# EAGLE design emonVS (EAGLE 9.6.2)
AUTHOR: OpenEnergyMonitor; IGNORE_RENUMBER: F;RV; SOURCE: github.com/openenergymonitor/emonVoltageSense; VERSION: 1.3.2
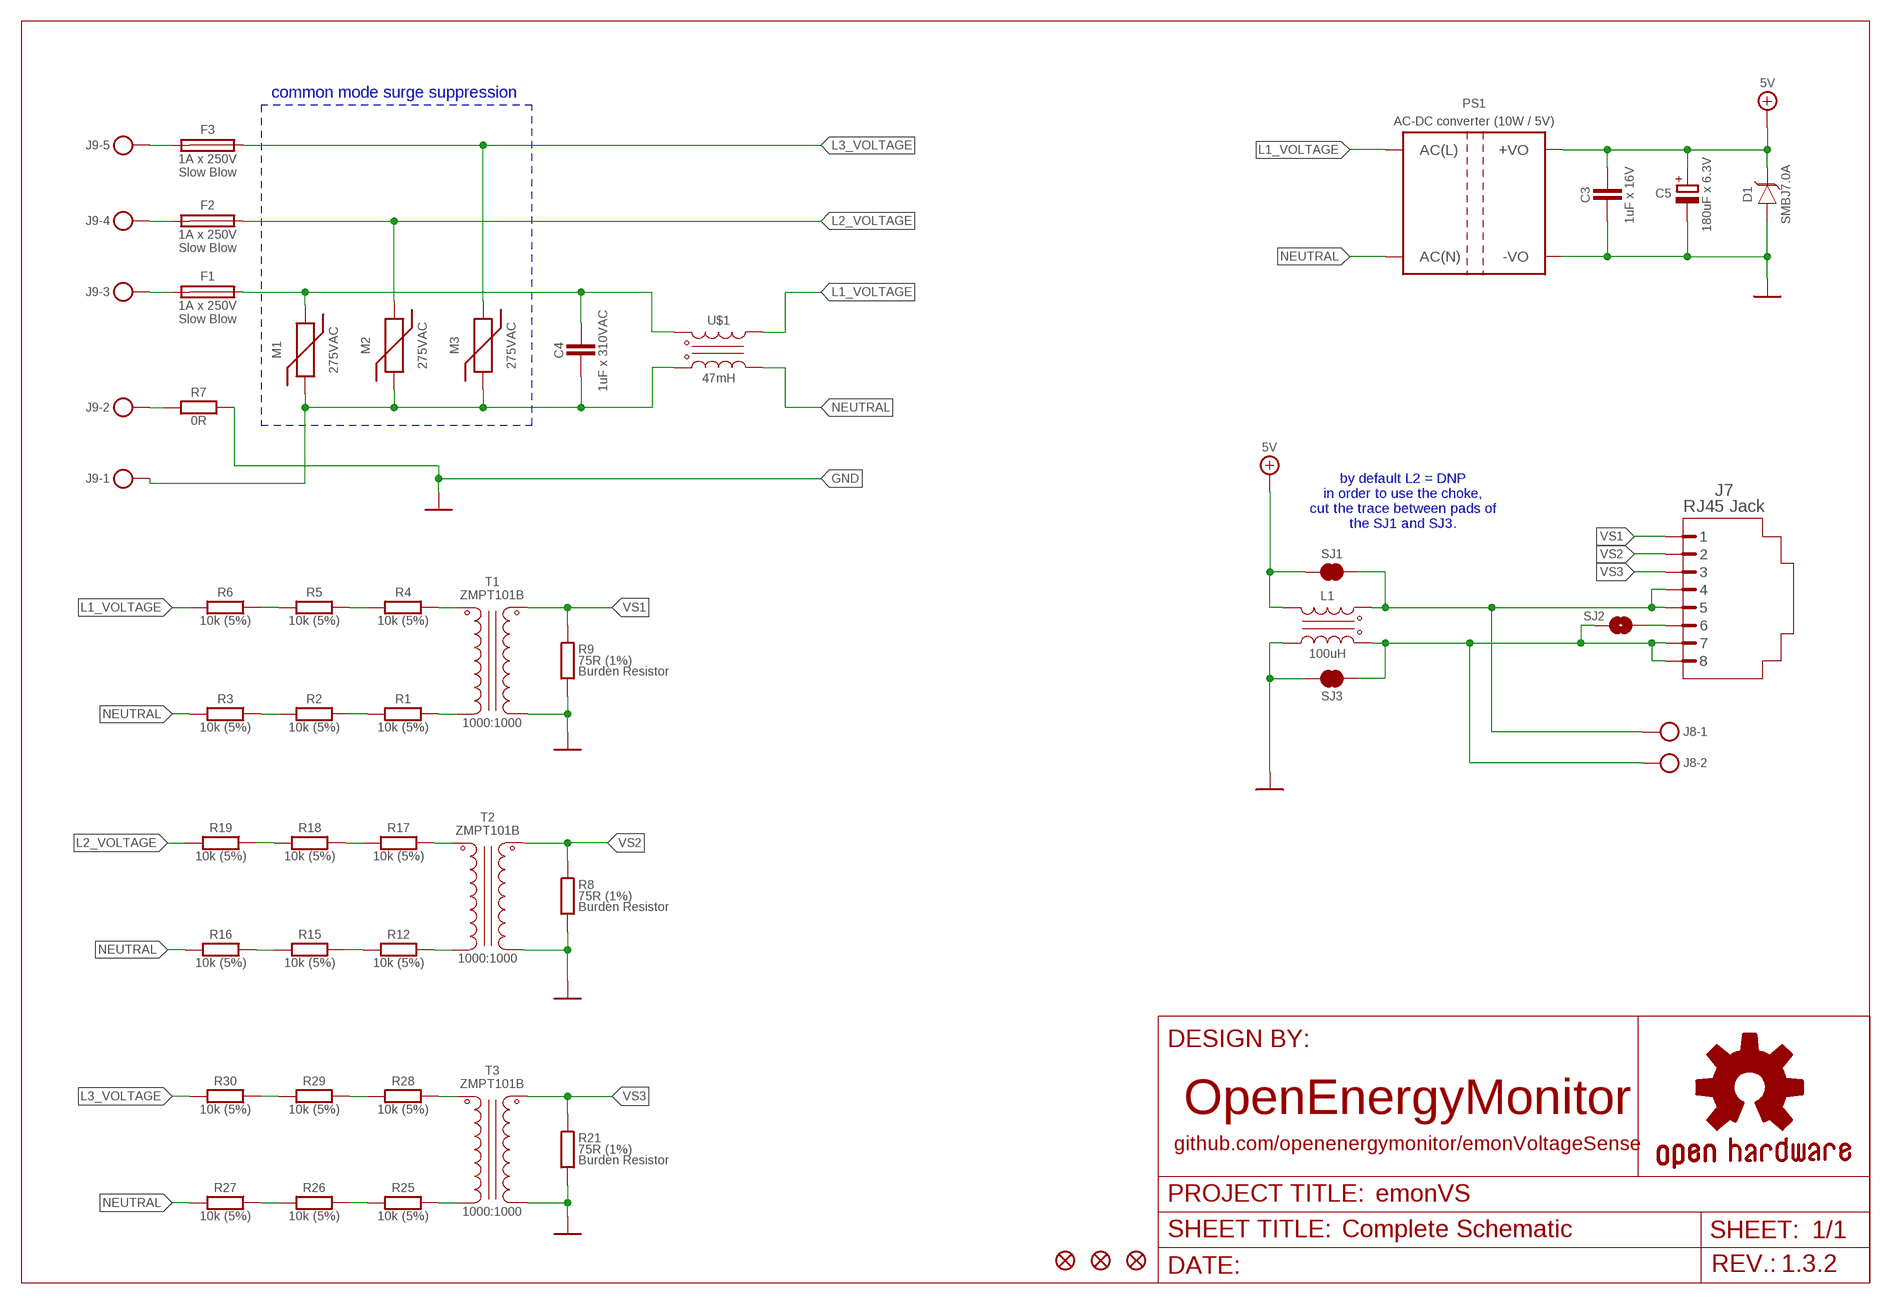
[diagram p0: schematic, sheet 1]

## Parts
C3  1uF x 16V  C_0603  [C0603]
C4  1uF x 310VAC  C_  [C_PTH]
C5  180uF x 6.3V  CP_SV-C  [CSV-C]
D1  TVS  [DO-214AA]
F1  1A x 250V  FUSE  [FUSE]
F2  1A x 250V  FUSE  [FUSE]
F3  1A x 250V  FUSE  [FUSE]
FD1  FIDUCIAL1X2  [FIDUCIAL]
FD2  FIDUCIAL1X2  [FIDUCIAL]
FD3  FIDUCIAL1X2  [FIDUCIAL]
J7  RJ45 Jack  RJ45-8PPTH  [RJ45-8P]
J8  TERMINAL_BLOCK_2P  [TERMINAL_BLOCK_2P]
J9  TERMINAL_BLOCK_5P  [TERMINAL_BLOCK_5P]
L1  100uH  CHOKES-WE-SL3  [CHOKE_WURTH]
M1  275VAC  MOV_14MM_275VAC  [MOV]
M2  275VAC  MOV_14MM_275VAC  [MOV]
M3  275VAC  MOV_14MM_275VAC  [MOV]
PS1  AC-DC converter (10W / 5V)  MULTICOMP-AC/DC  [MULTICOMP-AC/DC]
R1  10k (5%)  R_1206  [R1206]
R2  10k (5%)  R_1206  [R1206]
R3  10k (5%)  R_1206  [R1206]
R4  10k (5%)  R_1206  [R1206]
R5  10k (5%)  R_1206  [R1206]
R6  10k (5%)  R_1206  [R1206]
R7  0R  R_1206  [R1206]
R8  75R (1%)  R_  [R_PTH_SMD]
R9  75R (1%)  R_  [R_PTH_SMD]
R12  10k (5%)  R_1206  [R1206]
R15  10k (5%)  R_1206  [R1206]
R16  10k (5%)  R_1206  [R1206]
R17  10k (5%)  R_1206  [R1206]
R18  10k (5%)  R_1206  [R1206]
R19  10k (5%)  R_1206  [R1206]
R21  75R (1%)  R_  [R_PTH_SMD]
R25  10k (5%)  R_1206  [R1206]
R26  10k (5%)  R_1206  [R1206]
R27  10k (5%)  R_1206  [R1206]
R28  10k (5%)  R_1206  [R1206]
R29  10k (5%)  R_1206  [R1206]
R30  10k (5%)  R_1206  [R1206]
SJ1  SOLDER_JUMPER_2P_NC  [SJ_2S-NC]
SJ2  SOLDER_JUMPER_2P_NO  [SJ_2S-NO]
SJ3  SOLDER_JUMPER_2P_NC  [SJ_2S-NC]
T1  ZMPT101B  [ZMPT101B]
T2  ZMPT101B  [ZMPT101B]
T3  ZMPT101B  [ZMPT101B]
U$1  47mH  CHOKES-SCHAFFNER-RN214+RN212  [CHOKE_SCHAFFNER]

## Nets
5.0V: C3.1 C5.+ D1.1(K) L1.6 PS1.+VO PS1.+VO_2(+VO) SJ1.1 ; supply symbol labelled 5V
5VF: J7.4 J7.5 J8.2 L1.1 SJ1.2
GND: C3.2 C5.- D1.2(A) L1.4 PS1.-VO PS1.-VO_2(-VO) R7.1 R8.1A R8.1B R9.1A R9.1B R21.1A R21.1B SJ3.1 T1.4(SEC_1) T2.4(SEC_1) T3.4(SEC_1) ; supply symbol labelled 0V
GNDF: J7.7 J7.8 J8.1 L1.3 SJ2.1 SJ3.2
L1_VOLTAGE: PS1.AC(L) PS1.AC(L)_2(AC(L)) R6.2 U$1.4A U$1.4B
L2_VOLTAGE: F2.OUT M2.1 R19.2
L3_VOLTAGE: F3.OUT M3.1 R30.2
N$1: R4.1 T1.2(PRI_1)
N$2: R1.1 T1.1(PRI_2)
N$3: R1.2 R2.1
N$4: R4.2 R5.1
N$5: R5.2 R6.1
N$6: R2.2 R3.1
N$7: F1.IN J9.3
N$8: F2.IN J9.4
N$9: J7.6 SJ2.2
N$10: R17.1 T2.2(PRI_1)
N$11: R12.1 T2.1(PRI_2)
N$12: R12.2 R15.1
N$13: R17.2 R18.1
N$14: R18.2 R19.1
N$15: R15.2 R16.1
N$16: F3.IN J9.5
N$17: C4.1A C4.1B J9.1 M1.2 M2.2 M3.2 U$1.1A U$1.1B
N$18: R28.1 T3.2(PRI_1)
N$19: R25.1 T3.1(PRI_2)
N$20: J9.2 R7.2
N$21: R25.2 R26.1
N$22: R28.2 R29.1
N$23: R29.2 R30.1
N$24: R26.2 R27.1
N$29: C4.2A C4.2B F1.OUT M1.1 U$1.2A U$1.2B
NEUTRAL: PS1.AC(N) PS1.AC(N)_2(AC(N)) R3.2 R16.2 R27.2 U$1.3A U$1.3B
VS1: J7.1 R9.2A R9.2B T1.3(SEC_2)
VS2: J7.2 R8.2A R8.2B T2.3(SEC_2)
VS3: J7.3 R21.2A R21.2B T3.3(SEC_2)

## Notes on the sheet
- common mode surge suppression
- by default L2 = DNP
  in order to use the choke,
  cut the trace between pads of
  the SJ1 and SJ3.

## Library data of the parts
C3 = My-RLC:C_: NON-POLARIZED CAP; PN: GCM188R71C105KA64D
C4 = OpenEnergyMonitor:C_: NON-POLARIZED CAP; PN: B32923C3105M000; PN1: B32923C3105M; PN2: DE2F3KY103MA3BM02F
C5 = My-RLC:CP_: POLARIZED CAP; PN: 6SVPE180M
D1 = My-Diodes:TVS; FAMILY: SMBJ7.0A; PN: SMBJ7.0A
F1-F3 = OpenEnergyMonitor:FUSE; FAMILY: Slow Blow; PN: MST 1A 250V
FD1-FD3 = OpenEnergyMonitor:FIDUCIAL: Fiducial Alignment Points Point-of-reference for pick-and-place machines and other optical instruments.
J7 = OpenEnergyMonitor:RJ45-8P: RJ45 Jack Simple RJ45, 8-pin connection - connector for common Cat5, Cat5e, and Cat6 Ethernet cables. Footprint not yet proven in production. Connector sku is PRT-00643; Breakout PCB sku is BOB-00716.; PN: PRT-00643
J8 = OpenEnergyMonitor:TERMINAL_BLOCK_2P: TE Connectivity - Fixed Terminal Blocks Number of Positions: 2 Position Pitch: 5 mm Connection Method: Screw Clamp Current Rating: 13.5 A Voltage Rating: 300 V Wire Gauge Min: 30 AWG Wire Gauge Max: 16 AWG; PN: 282836-2
J9 = OpenEnergyMonitor:TERMINAL_BLOCK_5P: TE Connectivity - Fixed Terminal Blocks Number of Positions: 5 Position Pitch: 5 mm Connection Method: Screw Clamp Current Rating: 13.5 A Voltage Rating: 300 V Wire Gauge Min: 30 AWG Wire Gauge Max: 16 AWG; PN: 282836-5
L1 = OpenEnergyMonitor:CHOKES: Schaffner Common Mode Chokes RN series Current-compensated Chokes; PN: 744252101
M1-M3 = OpenEnergyMonitor:MOV_: MOV - Metal-Oxide Varistor; PN: MOV-14D431KTR
PS1 = OpenEnergyMonitor:MULTICOMP-AC/DC: Multicomp PRO - AC to DC Converter Module This device supports 5W module (MP-LD05-23B05R2) (square footprint) and 10W module (MP-LD10-23B05R2) (rectangle footprint).; PN: MP-LD10-23B05R2
R1-R7 R12 R15-R19 R25-R30 = My-RLC:R_: RESISTOR; PN: ERJ-H3GJ103V
R8 R9 R21 = OpenEnergyMonitor:R_: Burden Resistors This footprint supports SMD 0603 package and PTH 0204 package.; DESCRIPTION: Burden Resistor; PN: ERJ-H3EF75R0V
SJ1 SJ3 = OpenEnergyMonitor:SOLDER_JUMPER_2P_NC: Solder Jumper Standard SMD solder jumper. Used to automate production. Two varients : Normally Open and Normally Closed are the same, but have different paste layers. NC will have a large amount of paste and should jumper during reflow.
SJ2 = OpenEnergyMonitor:SOLDER_JUMPER_2P_NO: Solder Jumper Standard SMD solder jumper. Used to automate production. Two varients : Normally Open and Normally Closed are the same, but have different paste layers. NC will have a large amount of paste and should jumper during reflow.
T1-T3 = OpenEnergyMonitor:ZMPT101B: Current-type Voltage Transformer Source: Datasheet; PN: ZMPT101B; RATIO: 1000:1000
U$1 = OpenEnergyMonitor:CHOKES: Schaffner Common Mode Chokes RN series Current-compensated Chokes; PN: RN214-0.3-02-47M

## Net classes
0 default: clearance 0.205 mm
1 power: width 0.305 mm, drill 0.6 mm, clearance 0.254 mm
2 gnd: width 0.254 mm, drill 0.6 mm, clearance 0.254 mm

## Board
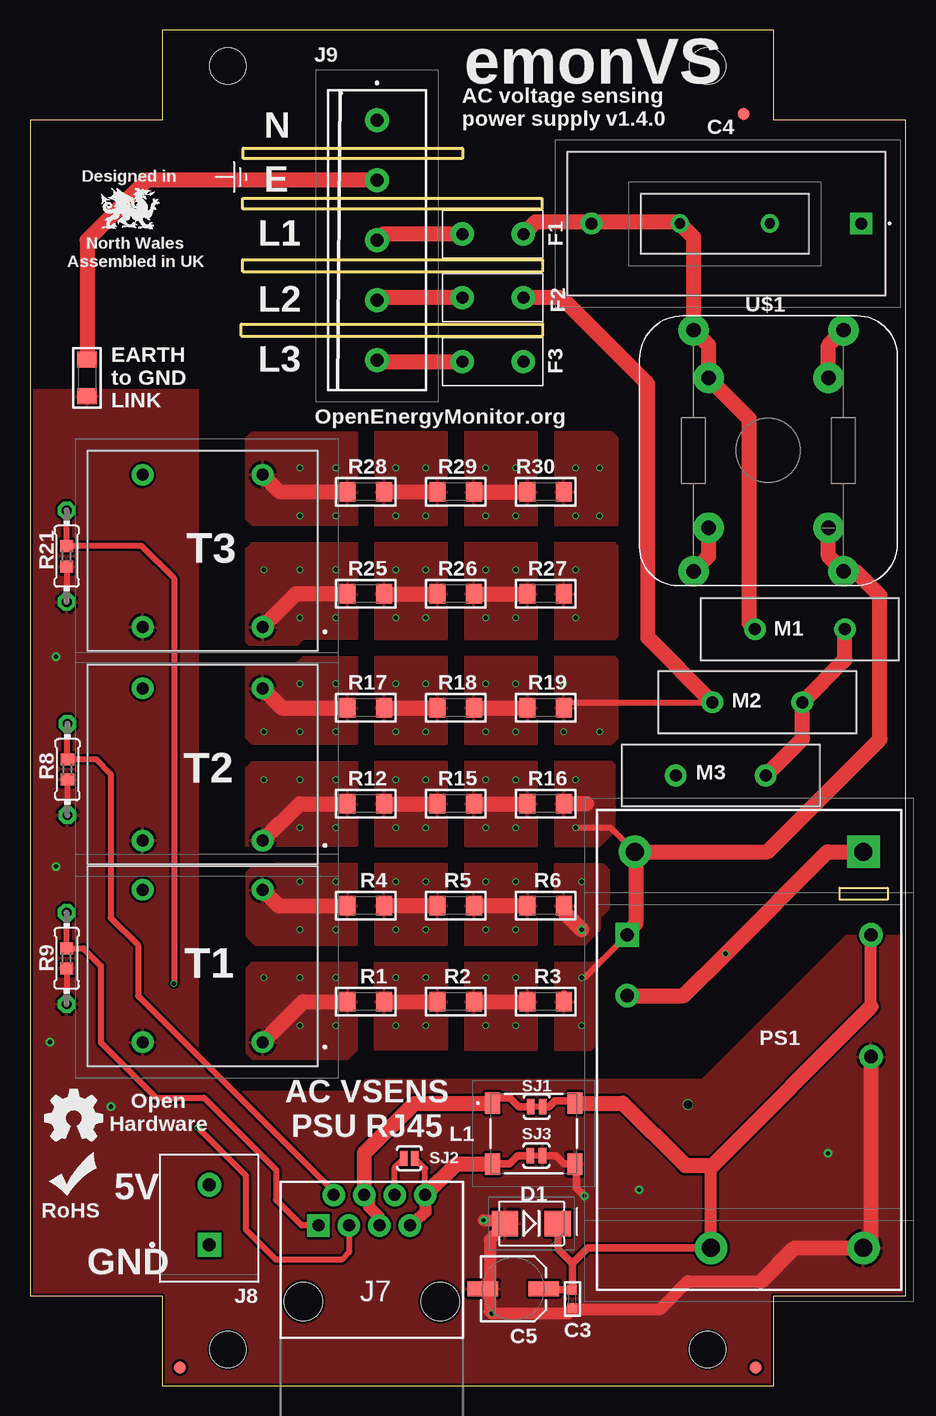
[diagram p1: board, top side]
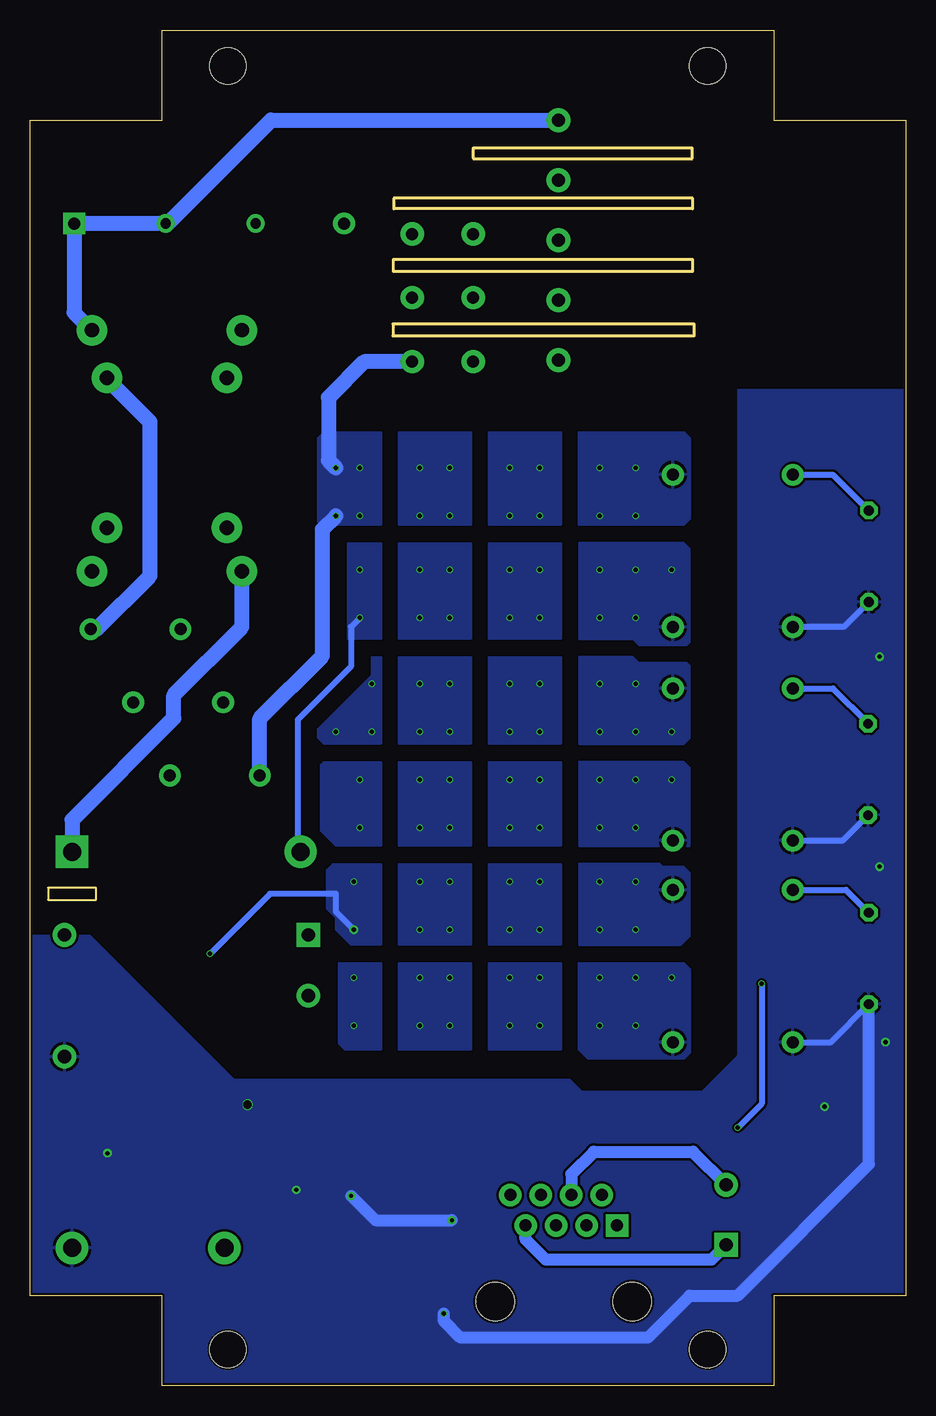
[diagram p2: board, bottom side, seen from below]

Size 73 x 113 mm. Coordinates in mm from the lower left corner, seen from the top.
Outline: 0,7.5 11,7.5 11,0 62,0 62,7.5 73,7.5 73,105.5 62,105.5 62,113 11,113 11,105.5 0,105.5 0,7.5
Copper layers (1*16): Top 0.035mm / dielectric 1.6mm / Bottom 0.035mm
Design rules "jlcpcb-2layers *": minimum track width 5mil, minimum drill 0.3mm, track to track 5mil, track to pad 5mil, pad to pad 5mil, via to via 5mil, smd to smd 5mil, copper to edge 0.2mm, drill to drill 6mil, minimum pad ring 10mil, minimum via ring 3mil, stop-mask expansion 4mil, vias tented up to drill 14mil, thermal gap 10mil
Holes 3 mm at 16.5,3 16.5,110 56.5,3 56.5,110
tKeepout: area 13.5,0 to 19.5,6; area 53.5,0 to 59.5,6; area 53.5,107 to 59.5,113; area 13.5,107 to 19.5,113; area 25,108.5 to 48.5,113; area 25,0 to 48.5,4.5
Milling: 20 lines

### Footprints (pad centres in the part's own frame; a part is rotated, then mirrored left to right if it is on the bottom)
C0603 = smd 0.8 x 0.8: 1 -0.762,0; 2 0.762,0
C_PTH = drill 1 pad 1.5 square: 1A 0,0 | drill 0.85 pad 1.381: 1B 0,7.62; 2B 0,15.12 | drill 1 pad 1.5: 2A 0,22.5
CSV-C = smd 2.54 x 1.27: + -2.54,0; - 2.54,0
DO-214AA = smd 2.2 x 2.15: 1 -2.2,0; 2 2.2,0
FUSE = drill 1 pad 1.93: IN 2,1.66; OUT 2,6.74
FIDUCIAL = smd 1 x 1: 1 0,0
RJ45-8P = drill 1 pad 1.88 square: 1 -4.445,6.35 | drill 1 pad 1.88: 2 -3.175,8.89; 3 -1.905,6.35; 4 -0.635,8.89; 5 0.635,6.35; 6 1.905,8.89; 7 3.175,6.35; 8 4.445,8.89 | hole 3.2: -5.715,0; 5.715,0
TERMINAL_BLOCK_2P = drill 1.1 pad 1.6 square: 1 -2.5,0 | drill 1.1 pad 1.6: 2 2.5,0
TERMINAL_BLOCK_5P = drill 1.1 pad 1.65: 1 0,0; 2 5,0; 3 10,0; 4 15,0; 5 20,0
CHOKE_WURTH = smd 1.78 x 1.27: 1 -2.54,-3.43; 3 2.54,-3.43; 4 2.54,3.43; 6 -2.54,3.43
MOV = drill 1 pad 1.5: 1 0,0; 2 7.5,0
MULTICOMP-AC/DC = drill 1.5 pad 2.25: +VO -5.72,-17.526; -VO 6.985,-17.526; AC(N) -12.065,15.494 | drill 1.1 pad 1.65: +VO_2 7.62,8.572; -VO_2 7.62,-1.587; AC(L)_2 -12.7,3.493 | drill 1.5 pad 2.25 square: AC(L) 6.985,15.494 | drill 1.1 pad 1.65 square: AC(N)_2 -12.7,8.572
R1206 = smd 1.3 x 1.6: 1 -1.524,0; 2 1.524,0
R_PTH_SMD = drill 0.813 octagon: 1A -3.81,0; 2A 3.81,0 | smd 1 x 1.1: 1B -0.85,0; 2B 0.85,0
SJ_2S-NC = smd 0.635 x 1.27: 1 -0.508,0; 2 0.508,0
SJ_2S-NO = smd 0.635 x 1.27: 1 -0.45,0; 2 0.45,0
ZMPT101B = drill 1 pad 1.5: 1 0,0; 2 0,-12.7; 3 10,-12.7; 4 10,0
CHOKE_SCHAFFNER = drill 1.2 pad 2.54: 1A -6.332,-9.976; 1B -5.07,-5.993; 2A 6.168,-9.976; 2B 4.93,-5.993; 3A -6.332,10.124; 3B -5.07,6.507; 4A 6.168,10.124; 4B 4.93,6.507

### Placement (x,y rotation side)
C3  45.22,7.22 270 top
C4  69.31,96.87 90 top
C5  40.3,8.06 180 top
D1  41.81,13.5 180 top
F1  34.39,98 270 top
F2  34.39,92.67 270 top
F3  34.39,87.35 270 top
FD1  12.5,1.5 0 top
FD2  60.5,1.5 0 top
FD3  59.5,106 0 top
J7  28.5,7 0 top
J8  14.95,14.24 90 top
J9  28.93,105.49 270 top
L1  42,21 270 top
M1  60.45,63.05 0 top
M2  56.9,56.95 0 top
M3  53.85,50.86 0 top
PS1  62.5,29 0 top
R1  28,32 0 top
R2  35.5,32 0 top
R3  43,32 0 top
R4  28,40 0 top
R5  35.5,40 0 top
R6  43,40 0 top
R7  4.75,84 90 top
R8  3.12,51.35 90 top
R9  3.06,35.6 90 top
R12  28,48.5 0 top
R15  35.5,48.5 0 top
R16  43,48.5 0 top
R17  28,56.5 0 top
R18  35.5,56.5 0 top
R19  43,56.5 0 top
R21  3.06,69.13 90 top
R25  28,66 0 top
R26  35.5,66 0 top
R27  43,66 0 top
R28  28,74.5 0 top
R29  35.5,74.5 0 top
R30  43,74.5 0 top
SJ1  42.25,23.24 180 top
SJ2  31.62,18.95 180 top
SJ3  42.22,19.17 180 top
T1  19.39,28.62 180 top
T2  19.39,45.42 180 top
T3  19.39,63.23 180 top
U$1  61.5,78 180 top

### Tracks (layer width: path | path; a pad name or v marks a point on that pad's centre or on a via)
5.0V
  Top 0.61: C5.+ 42.92,7.98 C3.1 45.22,10.18 | D1.1 44.01,11.39 45.22,10.18 | 45.22,10.18 46.52,11.48 PS1.+VO | SJ1.1 43.26,23.24 43.76,23.74 45.23,23.74 L1.6
  Top 1.016: PS1.+VO 56.78,18.23 56.8,18.24 | 70.12,31.57 PS1.+VO_2
  Top 1.27: 70.12,31.57 56.8,18.24 56.69,18.34 54.63,18.34 49.43,23.54 L1.6
5VF
  Top 0.508: L1.1 38.57,23.8 38.77,24
  Top 0.61: SJ1.2 40.76,23.24 40,24 38.77,24 38.71,23.94
  Top 1.016: J7.4 28.26,15.49 28.26,14.91 29.14,14.04 J7.5
  Top 1.27: J7.4 27.86,19.36 32,23.5 38.53,23.5 L1.1
  Bottom 1.016: J7.4 27.86,17.64 26,19.5 17.71,19.5 J8.2
GND  (via drill 0.35, 0.35 pad 0.7, 0.7 pad 0.7)
  Top 0.508: 39.39,13.77 39.66,13.5 | R21.1B R21.1A | R8.1B R8.1A | R9.1B R9.1A
  Top 0.61: v46.23,15.8 45.58,16.45 45.58,17.58 | SJ3.1 43.83,19.17 44.54,18.46 L1.4
  Top 1.016: 60.96,8.69 54.86,8.69 52.54,6.37 45.22,6.37 44.85,6 v38.5,6 38.33,6.17 38.33,12.18 39.66,13.5 | v37.82,13.77 39.39,13.77 | L1.4
  Top 1.27: PS1.-VO_2 70.12,12.11 PS1.-VO 63.74,11.47 60.96,8.69
  Bottom 0.508: T3.4 5.15,63.23 R21.1A | R8.1A 5.25,45.42 T2.4 | T1.4 6.23,28.62 R9.1A
  Bottom 1.016: v46.23,15.8 44.2,13.77 v37.82,13.77 | v38.5,6 38.5,5.41 37.09,4 21.5,4 18,7.5 14,7.5 3.06,18.44 R9.1A
  other vias: 50.8,16.31 54.86,23.42 66.55,19.36 6.75,23.25 1.66,28.62 2.16,60.76 2.16,43.26
  pour Top: -0.5,83 -0.5,7 10.5,7 10.5,-4.5 62.5,-4.5 62.5,7 73.5,7 74,7.5 74,37.5 68,37.5 56,25.5 28,25.5 27,24.5 17,24.5 14,27.5 14,83
  pour Bottom: 14,83 14,27.5 17,24.5 27,24.5 28,25.5 56,25.5 68,37.5 74,37.5 74,7.5 73.5,7 62.5,7 62.5,-5 10,-5 10,6.5 -1,6.5 -1,83
GNDF
  Top 0.508: J7.8 32.95,18.07 SJ2.1
  Top 0.61: SJ3.2 40.67,19.17 39.96,18.46 L1.3
  Top 1.016: J7.7 33.02,14.5 J7.8
  Top 1.27: J7.8 35.55,18.5 38.53,18.5 L1.3
  Bottom 1.016: J7.7 31.68,12.18 30,10.5 16.17,10.5 14.95,11.72 J8.1
L1_VOLTAGE  (via drill 0.35, 0.35 pad 0.7)
  Top 1.27: U$1.4B 56.57,69.11 U$1.4A | R6.2 44.52,39.48 v46,38 | PS1.AC(L)_2 54.49,32.49 v58,36 66.49,44.49 PS1.AC(L)
  Bottom 0.508: v46,38 47.5,39.5 47.5,41 53,41 v58,36
  Bottom 0.61: PS1.AC(L)_2 49.51,32.49
  Bottom 1.27: U$1.4A 55.33,63.24 61.01,57.56 61.01,55.63 69.48,47.16 PS1.AC(L)
  other vias: 46,42
  pour Top: 43.75,43.5 47.75,43.5 48.25,43 48.25,39.75 47.5,39 47.5,38 46.25,36.75 43.75,36.75
  pour Bottom: 43.75,43.5 43.75,36.75 46.25,36.75 47.5,38 47.5,39 48.25,39.75 48.25,43 47.75,43.5
L2_VOLTAGE  (via drill 0.35)
  Top 0.508: R19.2 44.98,56.95 M2.1
  Top 1.27: F2.OUT 44.33,90.67 51.5,83.5 51.5,62.35 M2.1
  other vias: 44.5,54.5 44.5,58.5 47.5,54.5
  pour Top: 43.75,60.75 43.75,53.5 48.5,53.5 49,54 49,60.5 48.75,60.75
  pour Bottom: 43.75,53.5 48.5,53.5 49,54 49,54.75 44.5,59.25 44.5,60.75 43.75,60.75
L3_VOLTAGE  (via drill 0.35)
  Bottom 1.27: M3.1 53.85,55.59 48.62,60.82 48.62,71.38 v47.5,72.5 | F3.OUT 45.13,85.35 48.12,82.36 48.12,77.12 v47.5,76.5
  other vias: 45.5,76.5 45.5,72.5
  pour Top: 43.75,79.5 43.75,71.75 49,71.75 49,79 48.5,79.5
  pour Bottom: 43.75,79.5 43.75,71.75 48.75,71.75 49,72 49,79 48.5,79.5
N$1  (via drill 0.35)
  Top 1.27: 19.69,41.02 T1.2 20.72,40 R4.1
  other vias: 25.5,42 25.5,38 22.5,42 22.5,38
  pour Top: 27.25,43.5 20.5,43.5 20.25,43.25 18.5,43.25 18,42.75 18,37.5 18.75,36.75 27.25,36.75
  pour Bottom: 27.25,43.5 27.25,36.75 18.75,36.75 18,37.5 18,42.75 18.5,43.25 20.25,43.25 20.5,43.5
N$2  (via drill 0.35)
  Top 0.508: 19.51,28.5 T1.1
  Top 1.27: 19.74,28.98 T1.1 22.77,32 R1.1
  other vias: 25.5,34 25.5,30 22.5,30 22.5,34 19.5,34
  pour Top: 27.25,35.25 18.5,35.25 18,34.75 18,27.75 18.5,27.25 26.5,27.25 27.25,28
  pour Bottom: 18.5,35.25 18,34.75 18,27.75 18.5,27.25 26.5,27.25 27.25,28 27.25,35.25
N$3  (via drill 0.35)
  Top 1.27: R1.2 R2.1
  other vias: 30.5,34 33,34 33,30 30.5,30
  pour Top: 28.75,35.25 34.75,35.25 34.75,28 28.75,28
  pour Bottom: 28.75,35.25 28.75,28 34.75,28 34.75,35.25
N$4  (via drill 0.35)
  Top 1.27: R5.1 R4.2
  other vias: 30.5,42 33,42 33,38 30.5,38
  pour Top: 28.75,43.5 28.75,36.75 34.75,36.75 34.75,43.5
  pour Bottom: 28.75,43.5 28.75,36.75 34.75,36.75 34.75,43.5
N$5  (via drill 0.35)
  Top 1.27: R6.1 R5.2
  other vias: 38,42 40.5,42 38,38 40.5,38
  pour Top: 36.25,43.5 36.25,36.75 42.25,36.75 42.25,43.5
  pour Bottom: 36.25,43.5 36.25,36.75 42.25,36.75 42.25,43.5
N$6  (via drill 0.35)
  Top 1.27: R2.2 R3.1
  other vias: 38,34 40.5,34 40.5,30 38,30
  pour Top: 36.25,35.25 36.25,28 42.25,28 42.25,35.25
  pour Bottom: 36.25,35.25 36.25,28 42.25,28 42.25,35.25
N$7
  Top 1.27: F1.IN 29.45,96 J9.3
N$8
  Top 1.27: F2.IN 29.12,90.67 J9.4
N$9
  Top 0.508: J7.6 30.41,18.18 SJ2.2
N$10  (via drill 0.35)
  Top 1.27: T2.2 21.01,56.5 R17.1
  other vias: 25.5,58.5 25.5,54.5 22.5,54.5 19.5,54.5 22.5,58.5
  pour Top: 27.25,53.5 18.5,53.5 18,54 18,60 18.25,60.25 22.25,60.25 22.75,60.75 27.25,60.75
  pour Bottom: 27.25,60.75 27.25,53.5 18.5,53.5 18,54 18,60 18.25,60.25 22.25,60.25 22.75,60.75
N$11  (via drill 0.35)
  Top 0.508: 19.54,45.27 T2.1
  Top 1.27: T2.1 22.47,48.5 R12.1
  other vias: 25.5,50.5 25.5,46.5 22.5,50.5 22.5,46.5 19.5,50.5
  pour Top: 27.25,52 27.25,45 18,45 18,51.5 18.5,52
  pour Bottom: 27.25,52 27.25,45 18,45 18,51.5 18.5,52
N$12  (via drill 0.35)
  Top 1.27: R12.2 R15.1
  other vias: 30.5,50.5 33,50.5 33,46.5 30.5,46.5
  pour Top: 28.75,52 28.75,45 34.75,45 34.75,52
  pour Bottom: 28.75,52 28.75,45 34.75,45 34.75,52
N$13  (via drill 0.35)
  Top 1.27: R17.2 R18.1
  other vias: 33,58.5 30.5,58.5 30.5,54.5 33,54.5
  pour Top: 28.75,60.75 28.75,53.5 34.75,53.5 34.75,60.75
  pour Bottom: 28.75,60.75 28.75,53.5 34.75,53.5 34.75,60.75
N$14  (via drill 0.35)
  Top 1.27: R18.2 R19.1
  other vias: 38,58.5 38,54.5 40.5,54.5 40.5,58.5
  pour Top: 36.25,60.75 36.25,53.5 42.25,53.5 42.25,60.75
  pour Bottom: 36.25,60.75 36.25,53.5 42.25,53.5 42.25,60.75
N$15  (via drill 0.35)
  Top 1.27: R15.2 R16.1
  other vias: 38,50.5 40.5,50.5 40.5,46.5 38,46.5
  pour Top: 36.25,52 36.25,45 42.25,45 42.25,52
  pour Bottom: 36.25,52 36.25,45 42.25,45 42.25,52
N$16
  Top 1.27: J9.5 29.07,85.35 F3.IN
N$17
  Top 1.27: U$1.1A 66.57,86.71 U$1.1B | M3.2 64.4,53.9 M2.2 67.95,60.51 M1.2
  Bottom 1.27: U$1.1B 66.57,83.9 63,80.33 63,67.5 67.45,63.05 M1.2 | U$1.1A 69.31,89.46 C4.1A C4.1B 61.69,96.69 52.9,105.49 J9.1
N$18  (via drill 0.35)
  Top 1.27: R28.1 20.82,74.5 T3.2
  other vias: 25.5,76.5 22.5,76.5 25.5,72.5 22.5,72.5
  pour Top: 27.25,71.75 18.5,71.75 18,72.25 18,79 18.5,79.5 27.25,79.5
  pour Bottom: 18.5,79.5 18,79 18,72.25 18.5,71.75 27.25,71.75 27.25,79.5
N$19  (via drill 0.35)
  Top 1.27: R25.1 22.16,66 T3.1
  other vias: 25.5,68 25.5,64 22.5,68 19.5,68 22.5,64
  pour Top: 27.25,70.25 27.25,62.25 22.75,62.25 22.25,61.75 18.25,61.75 18,62 18,69.75 18.5,70.25
  pour Bottom: 27.25,70.25 27.25,62.25 22.75,62.25 22.25,61.75 18.25,61.75 18,62 18,69.75 18.5,70.25
N$20
  Top 1.27: J9.2 9.74,100.49 4.75,95.5 R7.2
N$21  (via drill 0.35)
  Top 1.27: R25.2 R26.1
  other vias: 33,68 30.5,68 30.5,64 33,64
  pour Top: 28.75,62.25 34.75,62.25 34.75,70.25 28.75,70.25
  pour Bottom: 28.75,70.25 28.75,62.25 34.75,62.25 34.75,70.25
N$22  (via drill 0.35)
  Top 1.27: R29.1 R28.2
  other vias: 30.5,76.5 33,76.5 33,72.5 30.5,72.5
  pour Top: 28.75,71.75 34.75,71.75 34.75,79.5 28.75,79.5
  pour Bottom: 28.75,79.5 28.75,71.75 34.75,71.75 34.75,79.5
N$23  (via drill 0.35)
  Top 1.27: R29.2 R30.1
  other vias: 38,76.5 40.5,76.5 38,72.5 40.5,72.5
  pour Top: 36.25,71.75 42.25,71.75 42.25,79.5 36.25,79.5
  pour Bottom: 36.25,79.5 36.25,71.75 42.25,71.75 42.25,79.5
N$24  (via drill 0.35)
  Top 1.27: R26.2 R27.1
  other vias: 38,68 40.5,68 40.5,64 38,64
  pour Top: 36.25,70.25 36.25,62.25 42.25,62.25 42.25,70.25
  pour Bottom: 36.25,70.25 36.25,62.25 42.25,62.25 42.25,70.25
N$29
  Top 1.27: 56.48,83.99 U$1.2B | U$1.2B 56.57,86.74 U$1.2A 55.33,95.73 C4.2B 54.07,97 46.94,97 C4.2A | M1.1 59.95,63.55 59.95,80.61 U$1.2B | 47,96.69 C4.2A | F1.OUT 42.13,97 46.69,97 C4.2A
NEUTRAL  (via drill 0.35)
  Top 0.508: PS1.AC(N) 48.43,46.5 v45.5,46.5 | PS1.AC(N)_2 46.23,34 v46,34
  Top 1.27: U$1.3B 66.57,69.14 U$1.3A 68.82,67.88 70.86,65.84 70.86,53.88 61.48,44.49 PS1.AC(N) 50.5,44.43 50.5,38.5 49.8,37.8 PS1.AC(N)_2 | 46.43,48.5 R16.2 | R3.2 44.52,32.3
  Bottom 0.508: PS1.AC(N) 50.69,44.74 50.69,55.49 46.25,59.93 46.25,63.25 v45.5,64
  other vias: 46,30 45.5,50.5 45.5,68
  pour Top: 43.75,70.25 43.75,62.25 48.75,62.25 49,62.5 49,70 48.75,70.25
  pour Top: 43.75,52 43.75,45 47.5,45 48.75,46.25 48.75,51.75 48.5,52
  pour Top: 43.75,35.25 43.75,28 46.75,28 47.25,28.5 47.25,35.25
  pour Bottom: 43.75,52 43.75,45 47.5,45 48.75,46.25 48.75,51.75 48.5,52
  pour Bottom: 43.75,28 46.75,28 47.25,28.5 47.25,35.25 43.75,35.25
  pour Bottom: 43.75,70.25 43.75,62.25 46.5,62.25 46.5,70.25
VS1
  Top 0.508: R9.2A R9.2B 4.45,36.45 5.91,35 5.91,28.59 10.5,24 14.5,24 20.5,18 20.5,15.5 22.65,13.35 J7.1
  Bottom 0.508: T1.3 4.97,41.32 R9.2A
VS2
  Top 0.508: R8.2A R8.2B 3.34,52.2 3.35,52.21 5.5,52.21 6.71,51 6.71,39 9,36.72 9,32.5 25.32,16.18 J7.2
  Bottom 0.508: T2.3 6.06,58.12 3.12,55.19 R8.2A
VS3  (via drill 0.35)
  Top 0.508: R21.2A R21.2B 3.07,69.99 9.31,69.99 12,67.3 v12,33.5 | J7.3 26.59,11.1 26,10.5 20.5,10.5 18,13 18,17.5 v14,21.5
  Bottom 0.508: R21.2A 6.05,75.93 T3.3 | v12,33.5 12,23.5 v14,21.5

### Text on the board
tPlace: emonVS | AC voltage sensing / power supply | v1.4.0 | Designed in | North Wales | Assembled in UK | EARTH / to GND / LINK | OpenEnergyMonitor.org | Open / Hardware | RoHS
tNames: N | E | L1 | L2 | L3 | AC VSENS / PSU RJ45 | 5V | GND | J7